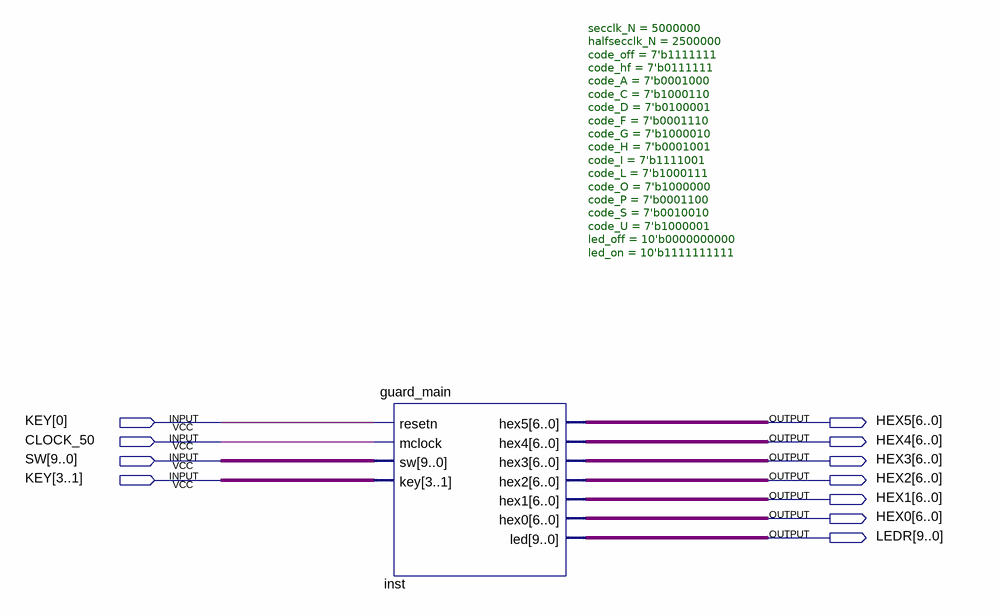
[diagram p0: schematic sheet]
// Quartus schematic guard.bdf as structural Verilog: 1 symbols, 11 pins
module guard (
  input  [3:0] KEY,
  input  CLOCK_50,
  input  [9:0] SW,
  output [6:0] HEX5,
  output [6:0] HEX4,
  output [6:0] HEX3,
  output [6:0] HEX2,
  output [6:0] HEX1,
  output [6:0] HEX0,
  output [9:0] LEDR
);

  guard_main #(.secclk_N(5000000), .halfsecclk_N(2500000), .code_off(7'b1111111), .code_hf(7'b0111111), .code_A(7'b0001000), .code_C(7'b1000110), .code_D(7'b0100001), .code_F(7'b0001110), .code_G(7'b1000010), .code_H(7'b0001001), .code_I(7'b1111001), .code_L(7'b1000111), .code_O(7'b1000000), .code_P(7'b0001100), .code_S(7'b0010010), .code_U(7'b1000001), .led_off(10'b0000000000), .led_on(10'b1111111111)) inst (
    .resetn(KEY[0]), .mclock(CLOCK_50), .sw(SW), .key(KEY[3:1]), .hex5(HEX5), .hex4(HEX4), .hex3(HEX3),
    .hex2(HEX2), .hex1(HEX1), .hex0(HEX0), .led(LEDR));
endmodule
